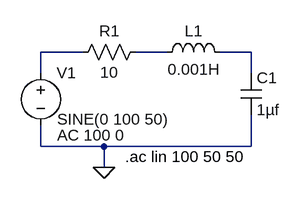
[diagram p0: schematic RLC_1_2.asc]
RLC_1_2.asc, the LTspice schematic file:
Version 4
SHEET 1 880 680
WIRE -64 80 -128 80
WIRE 64 80 16 80
WIRE 192 80 144 80
WIRE -128 112 -128 80
WIRE 192 112 192 80
WIRE -128 224 -128 192
WIRE -32 224 -128 224
WIRE 192 224 192 176
WIRE 192 224 -32 224
WIRE -32 256 -32 224
FLAG -32 256 0
SYMBOL res 32 64 R90
WINDOW 0 0 56 VBottom 2
WINDOW 3 32 56 VTop 2
SYMATTR InstName R1
SYMATTR Value 10
SYMBOL ind 48 96 R270
WINDOW 0 32 56 VTop 2
WINDOW 3 5 56 VBottom 2
SYMATTR InstName L1
SYMATTR Value 0.001H
SYMBOL cap 176 112 R0
SYMATTR InstName C1
SYMATTR Value 1µf
SYMBOL voltage -128 96 R0
WINDOW 3 25 87 Left 2
WINDOW 123 25 111 Left 2
WINDOW 39 0 0 Left 0
SYMATTR InstName V1
SYMATTR Value SINE(0 100 50)
SYMATTR Value2 AC 100 0
TEXT 0 240 Left 2 !.ac lin 100 50 50

The netlist it stands for:
* RLC_1_2.asc
R1 N002 N001 10
L1 N002 N003 0.001H
C1 N003 0 1µf
V1 N001 0 SINE(0 100 50) AC 100 0
.ac lin 100 50 50
.backanno
.end